# Altium schematic sheet SCHEMATICS.SchDoc: LCD T40-T9 Adapter for Raspberry Pi
size A4; Author: Meysam Parvizi; DrawnBy: Meysam Parvizi; SheetNumber: 1; SheetTotal: 1
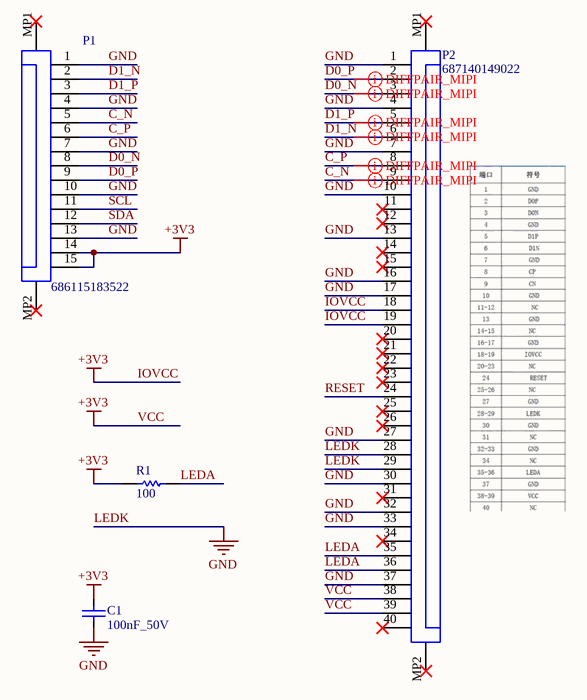
[diagram p0: SCHEMATICS.SchDoc]

## Parts
C1  value 100nF_50V  [C0805]  (hidden comment: CC0805KRX7R9BB104)
P1  686115183522  [686115183522]
P2  687140149022  [687140149022]
R1  value 100  [R0805]  (hidden comment: AC0805FR-07100RL)

## Nets
GND: C1.2 P1.1 P1.4 P1.7 P1.10 P1.13 P2.1 P2.4 P2.7 P2.10 P2.13 P2.16 P2.17 P2.27 P2.28 P2.29 P2.30 P2.32 P2.33 P2.37  [also labelled LEDK]
IOVCC: C1.1 P1.14 P1.15 P2.18 P2.19 P2.38 P2.39 R1.2  [also labelled +3V3, VCC]
C_N: P1.5 P2.9
C_P: P1.6 P2.8
D0_N: P1.8 P2.3
D0_P: P1.9 P2.2
D1_N: P1.2 P2.6
D1_P: P1.3 P2.5
LEDA: P2.35 P2.36 R1.1
RESET: P2.24
SCL: P1.11
SDA: P1.12

Not connected (* = marked no-connect by the designer): P1 MP1* MP2*; P2 11* 12* 14* 15* 20* 21* 22* 23* 25* 26* 31* 34* 40* MP1* MP2*

## Layout directives
differential pair; differential pair class MIPI: C_N, C_P, D0_N, D0_P, D1_N, D1_P

## Notes on the sheet
- Title:
- Designed By:
- Meysam Parvizi
- GitHub:
- https://github.com/m3y54m
- File:
- Project Git Hash:
- Project:
- Date:
- Sheet
- Revision:
- of
- Size:
- A4
- File Git Hash:

## Library data of the parts
C1 = CAPACITOR: 50V 100nF X7R ±10% 0805 Multilayer Ceramic Capacitors MLCC - SMD/SMT ROHS; Manufacturer: YAGEO; ComponentLink2Description: Datasheet; Package: 0805; ComponentLink2URL: https://content.kemet.com/datasheets/KEM_C1003_C0G_SMD.pdf; Mounting: SMD; Category: Capacitor
P1 = CON-FPC-1MM-15P-RA: 15 Position FFC, FPC Connector Contacts, Bottom 1.0mm Surface Mount, Right Angle; Category: *; Manufacturer: *; Manufacturer Part Number: *; Mounting: *; Package: *
P2 = CON-FPC-0.5MM-40P-RA: 40 Position FFC, FPC Connector Contacts, Bottom 0.020 (0.50mm) Surface Mount, Right Angle; Category: *; Manufacturer: *; Manufacturer Part Number: *; Mounting: *; Package: *
R1 = RESISTOR: 125mW Thick Film Resistors 150V ±100ppm/℃ ±1% -55℃~+155℃ 100Ω 0805 Chip Resistor - Surface Mount ROHS; Manufacturer: YAGEO; Mounting: SMD; Package: 0805; Category: Resistor